# EAGLE schematic SuperCap_Proto (EAGLE 6.4)
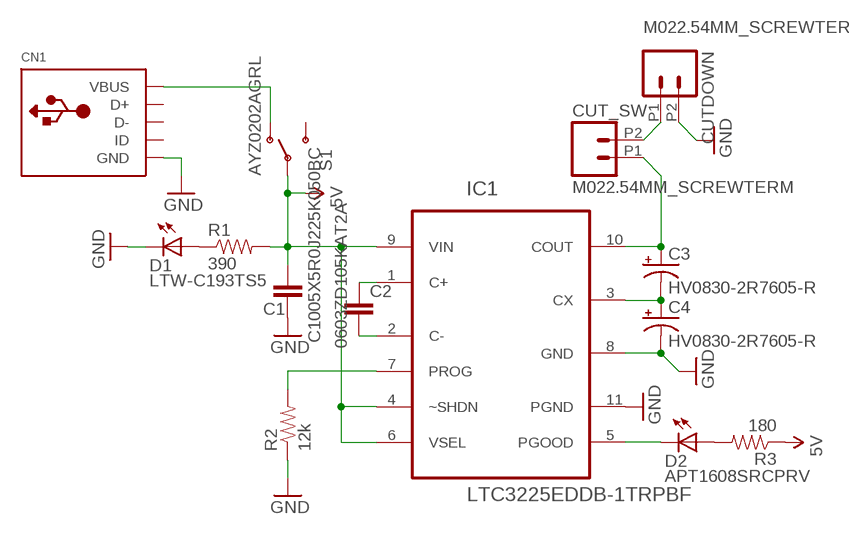
[diagram p0: schematic, sheet 1]

## Parts
C1  C1005X5R0J225K050BC  2.2UF-CERCAP-07888  [0402-CAP]
C2  0603ZD105KAT2A  1.0UF-16V-10%(0603)  [0603-CAP]
C3  HV0830-2R7605-R  [CAP_POL_RADIAL_6F_2.7V]
C4  HV0830-2R7605-R  [CAP_POL_RADIAL_6F_2.7V]
CN1  USBMINIB  [USB-MINIB]
CUT_SW  M022.54MM_SCREWTERM  [1X02_2.54_SCREWTERM]
CUTDOWN  M022.54MM_SCREWTERM  [1X02_2.54_SCREWTERM]
D1  LTW-C193TS5  LED0603  [LED-0603]
D2  APT1608SRCPRV  LED-RED0603  [LED-0603]
IC1  LTC3225EDDB-1TRPBF  [DFN300X200X80]
R1  390  RESISTOR0603  [0603-RES]
R2  12k  RESISTOR0603  [0603-RES]
R3  180  RESISTOR0603  [0603-RES]
S1  AYZ0202AGRL  SWITCH-SPDTSMD  [AYZ0202]

## Nets
5V [power]: C1.1 IC1.4(~SHDN) IC1.6(VSEL) IC1.9(VIN) R1.2 R3.1 S1.2(P)
GND [power]: C1.2 C4.P$2(-) CN1.GND CUTDOWN.P2 D1.C IC1.8(GND) IC1.11(PGND) R2.1
N$1 [CAP]: CUT_SW.P2 CUTDOWN.P1
N$2 [power]: C3.P$1(+) CUT_SW.P1 IC1.10(COUT)
N$3 [power]: CN1.VBUS S1.1(O)
N$4: D2.C IC1.5(PGOOD)
N$11: IC1.7(PROG) R2.2
N$15: D2.A R3.2
N$17: D1.A R1.1
N$18: C3.P$2(-) C4.P$1(+) IC1.3(CX)
N$21: C2.1 IC1.1(C+)
N$23: C2.2 IC1.2(C-)
Unconnected: CN1.D+ CN1.D- CN1.ID S1.3(S)

## Library data of the parts
C1 = SparkFun-Capacitors:2.2UF-CER: 2.2uF Ceramic SMT CAP-07888- 10V, 20% (0603) CAP-10009- 50V, 10% (1206); PROD_ID: CAP-07888; VALUE: 2.2uF
C2 = SparkFun-Capacitors:1.0UF-16V-10%(0603): CAP-00868; PROD_ID: CAP-00868; VALUE: 1.0uF
C3 C4 = wrea:HV0830-2R7605-R
CN1 = adafruit:USB: USB Connectors USBMINIB - Surface Mount Female Mini-B USB Connector 4UConnector: 06564 By microbuilder.eu Thru-hole RA Female Mini-B USB Connector 4UConnector: 18732 By ladyada.net
CUT_SW CUTDOWN = SparkFun-Connectors:M02: Standard 2-pin 0.1" header. Use with - straight break away headers ( PRT-00116) - right angle break away headers (PRT-00553) - swiss pins (PRT-00743) - machine pins (PRT-00117) - female headers (PRT-00115) Molex polarized connector foot print use with: PRT-08233 with associated crimp pins and housings. 2.54_SCREWTERM for use with PRT-10571. 3.5mm Screw Terminal footprints for PRT-08084 5mm Screw Terminal footprints for use with PRT-08433
D1 = SparkFun-LED:LED: LEDs Standard schematic elements and footprints for 5mm, 3mm, 1206, and 0603 sized LEDs. 5mm - Spark Fun Electronics SKU : COM-00529 (and others)
D2 = SparkFun-LED:LED-RED: Assorted Red LEDs LilyPad 1206- DIO-09912 1206- DIO-00809 0603- DIO-00819; PROD_ID: DIO-00819; VALUE: RED
IC1 = wrea:LTC3225EDDB-1TRPBF
R1-R3 = SparkFun-Resistors:RESISTOR: Resistor Basic schematic elements and footprints for 0603, 1206, and PTH resistors.
S1 = SparkFun-Electromechanical:SWITCH-SPDT: SPDT Switch Simple slide switch, Spark Fun Electronics SKU : COM-00102 DPDT SMT slide switch, AYZ0202, SWCH-08179; PROD_ID: SWCH-08179

## Net classes
0 default: width 0.254 mm, drill 0.305 mm, clearance 0.203 mm
1 power: width 0.254 mm, drill 0.406 mm, clearance 0.203 mm
2 CAP: width 3.048 mm, drill 0.406 mm, clearance 0.203 mm
3 power usb: width 0.254 mm, drill 0.406 mm, clearance 0.203 mm